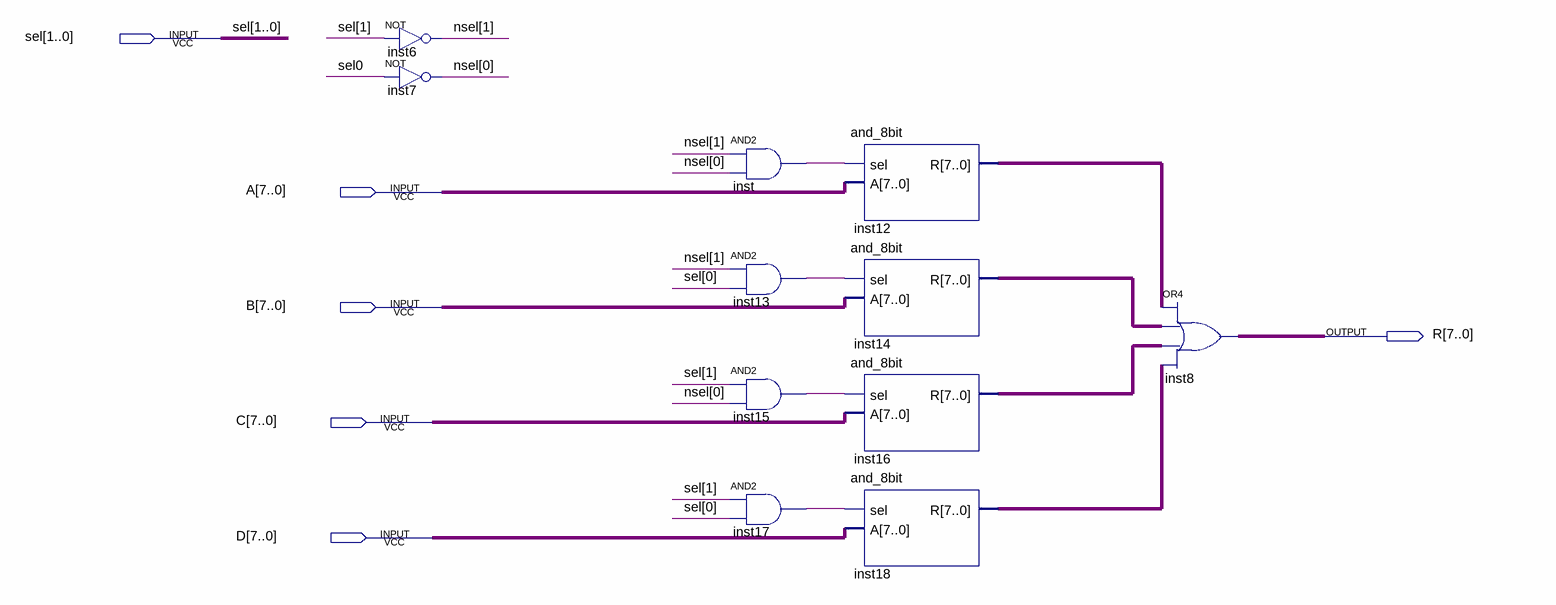
[diagram p0: schematic sheet]
// Quartus schematic sel4to1_8bit.bdf as structural Verilog: 11 symbols, 6 pins
module sel4to1_8bit (
  input  [1:0] sel,
  input  [7:0] A,
  input  [7:0] B,
  input  [7:0] C,
  input  [7:0] D,
  output [7:0] R
);

  wire inst13_out, inst15_out, inst17_out, inst_out;
  wire [1:0] nsel;
  wire [7:0] inst12_r, inst14_r, inst16_r, inst18_r;

  not inst6 (nsel[1], sel[1]);
  not inst7 (nsel[0], sel[0]);
  and inst (inst_out, nsel[1], nsel[0]);
  and inst13 (inst13_out, nsel[1], sel[0]);
  and inst15 (inst15_out, sel[1], nsel[0]);
  and inst17 (inst17_out, sel[1], sel[0]);
  and_8bit inst12 (.sel(inst_out), .A(A), .R(inst12_r));
  and_8bit inst14 (.sel(inst13_out), .A(B), .R(inst14_r));
  and_8bit inst16 (.sel(inst15_out), .A(C), .R(inst16_r));
  and_8bit inst18 (.sel(inst17_out), .A(D), .R(inst18_r));
  assign R = inst12_r | inst14_r | inst16_r | inst18_r;  // OR4 inst8, 8 bits wide
endmodule
